# Altium schematic sheet RS485 BUS.SchDoc
size A4; DrawnBy: Parsa Malekpour; Engineer: Parsa Malekpour; Organization: Atrotech; Address1: www.atrotech.ir; Address2: +98 90 369 22 999; Address3: Tehran; Address4: IRAN
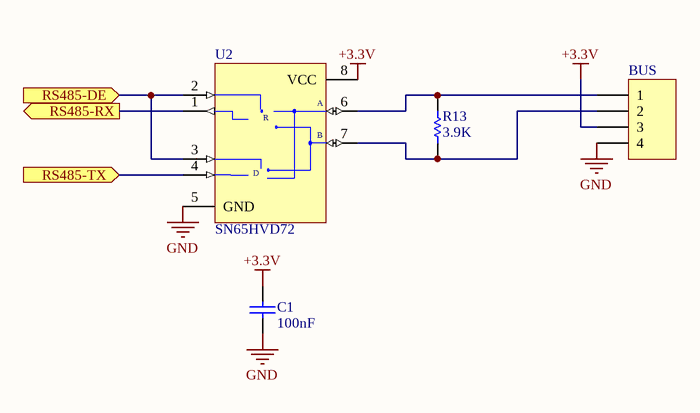
[diagram p0: RS485 BUS.SchDoc]

## Parts
BUS  BUS SOCKET  [PH-4]  (value not drawn)
C1  100nF  [C603]
R13  3.9K  [R805]
U2  SN65HVD72  [SOIC-8N]

## Ports
RS485-DE (in), RS485-RX (out), RS485-TX (in)

## Nets
+3.3V: BUS.3 C1.2 U2.8(VCC)
GND: BUS.4 C1.1 U2.5(GND)
RS485-DE: U2.2(~{RE}) U2.3(DE) ; port RS485-DE
RS485-RX: U2.1(RO) ; port RS485-RX
RS485-TX: U2.4(DI) ; port RS485-TX
NetBUS_1: BUS.1 R13.2 U2.6(A)
NetBUS_2: BUS.2 R13.1 U2.7(B)

## Notes on the sheet
- Title
- Size:
- Date:
- A4
- Number:
- Time:
- Revision:
- Sheet
- of
- Atrotech co.
- www.atrotech.ir <http://www.atrotech.ir>
- +98 90 369 22 999
- Tehran
- IRAN
- File:
- (in symbol SN65HVD72) R; D

## Library data of the parts
BUS = Header 4: LatestRevisionDate: 17-Jul-2002; LatestRevisionNote: Re-released for DXP Platform.; Publisher: Altium Limited
C1 = Cap: Capacitor; Designer: Parsa Malekpour; Value: 100nF
R13 = Resistor: Designer: Parsa Malekpour; Value: 3.9K
U2 = SN65HVD72: 3.3-V Supply RS-485 With IEC ESD protection; Published: 16-Jan-2001; LatestRevisionDate: 29-May-2009; LatestRevisionNote: Component Body Added.; DatasheetVersion: Feb-1996; PackageVersion: RevB, 21-0043; PackageReference: PA8; Publisher: Altium Limited; PackageDescription: DIP, 8-Pin, Row Spacing 7.62 mm, Pitch 2.54 mm; Code_JEDEC: MS-001-AB